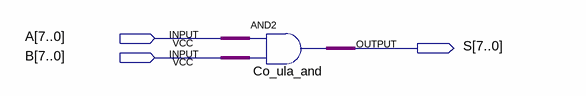
[diagram p0: schematic sheet]
// Quartus schematic and8x8.bdf as structural Verilog: 1 symbols, 3 pins
module and8x8 (
  input  [7:0] A,
  input  [7:0] B,
  output [7:0] S
);

  assign S = A & B;  // AND2 Co_ula_and, 8 bits wide
endmodule
